# EAGLE design current_limiter (EAGLE 9.5.2)
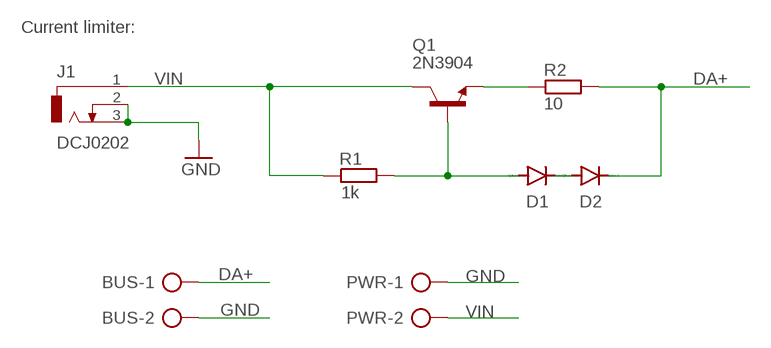
[diagram p0: schematic, sheet 1]

## Parts
BUS  AK500/2  [AK500/2]
D1  1N4004  [DO41-10]
D2  1N4004  [DO41-10]
J1  DCJ0202  [DCJ0202]
PWR  AK500/2  [AK500/2]
Q1  2N3904  BC449  [TO92-EBC]
R1  1k  R-EU_0207/10  [0207/10]
R2  10  R-EU_0207/10  [0207/10]

## Nets
DA+: BUS.1 D2.C R2.2
GND: BUS.2 J1.2 J1.3 PWR.1
N$2: D1.A Q1.B R1.2
N$8: D1.C D2.A
N$10: Q1.E R2.1
VIN: J1.1 PWR.2 Q1.C R1.1

## Notes on the sheet
- Current limiter:

## Library data of the parts
BUS PWR = con-ptr500:AK500/2: CONNECTOR; OC_FARNELL: unknown; OC_NEWARK: unknown
D1 D2 = diode:1N4004: DIODE general purpose rectifier, 1 A
J1 = con-jack:DCJ0202: DC POWER JACK Source: DCJ0202.pdf; OC_FARNELL: unknown; OC_NEWARK: unknown
Q1 = transistor-npn:BC449*: NPN Transistor
R1 R2 = rcl:R-EU_: RESISTOR, European symbol; SPICEPREFIX: R

## Board
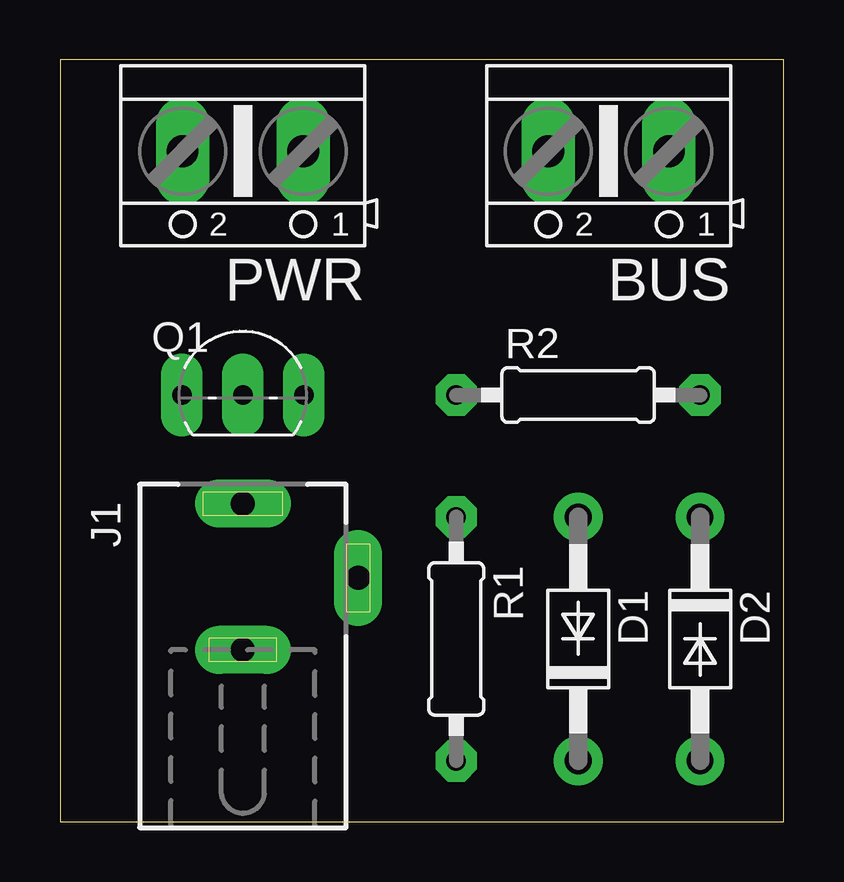
[diagram p1: board, top side]
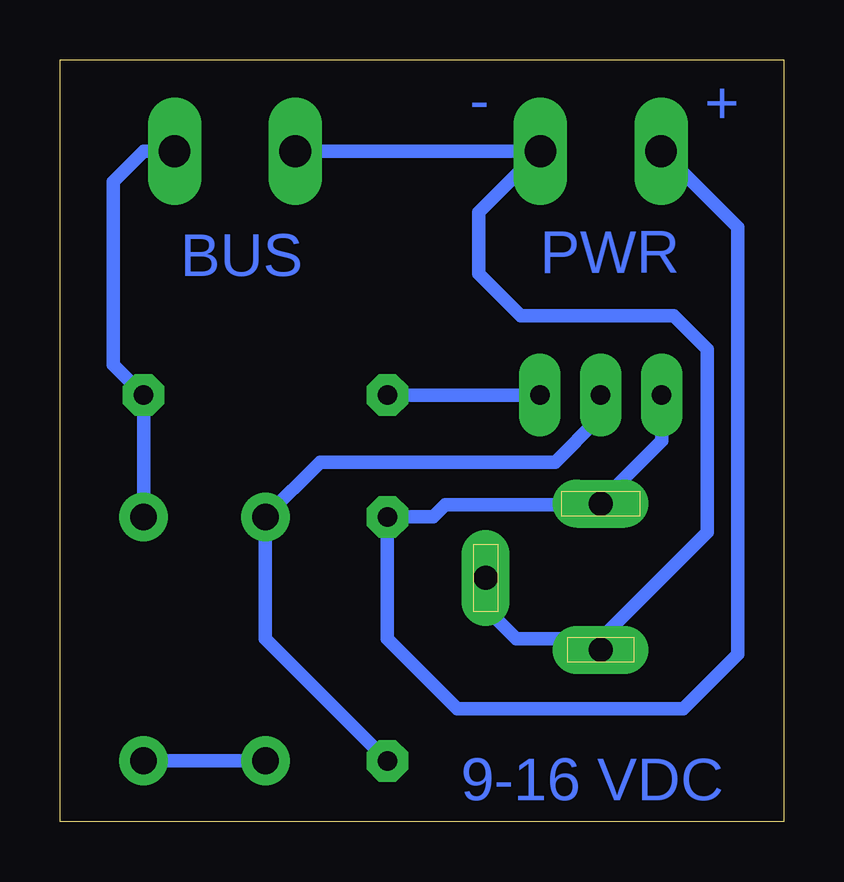
[diagram p2: board, bottom side, seen from below]

Size 30.15 x 31.74 mm. Coordinates in mm from the lower left corner, seen from the top.
Outline: 0,0 30.15,0 30.15,31.74 0,31.74 0,0
Copper layers (1*16): Top 0.035mm / dielectric 1.5mm / Bottom 0.035mm
Design rules "default *": minimum track width 22mil, minimum drill 0.35mm, track to track 18mil, track to pad 18mil, pad to pad 18mil, via to via 6mil, smd to smd 6mil, copper to edge 40mil, drill to drill 6mil, minimum pad ring 18mil, minimum via ring 8mil, stop-mask expansion 4mil, vias tented up to drill 0mil, thermal gap 10mil

### Footprints (pad centres in the part's own frame; a part is rotated, then mirrored left to right if it is on the bottom)
AK500/2 = drill 1.321 long: 1 -2.515,0; 2 2.515,0
DO41-10 = drill 1.118: A 5.08,0; C -5.08,0
DCJ0202 = drill 1 pad 2 long: 1 0,3.1; 2 4.8,0; 3 0,-3
TO92-EBC = drill 0.813 long: B 0,-1.27; C -2.54,-1.27; E 2.54,-1.27
0207/10 = drill 0.813 octagon: 1 -5.08,0; 2 5.08,0

### Placement (x,y rotation side)
BUS  22.86,27.94 180 top
D1  21.59,7.62 90 top
D2  26.67,7.62 270 top
J1  7.62,10.16 0 top
PWR  7.62,27.94 180 top
Q1  7.62,19.05 0 top
R1  16.51,7.62 270 top
R2  21.59,17.78 0 top

### Tracks (layer width: path | path; a pad name or v marks a point on that pad's centre or on a via)
DA+
  Bottom 0.559: D2.C R2.2 27.94,19.05 27.94,26.67 26.67,27.94 BUS.1
GND
  Bottom 0.559: 7.62,7.62 11.15,7.62 12.42,8.89 J1.2 | BUS.2 10.16,27.94 | 10.16,27.94 PWR.1 | 7.62,7.62 3.17,12.06 3.17,19.68 4.57,21.08 10.95,21.08 12.7,22.84 12.7,25.4 10.16,27.94 | 7.62,7.62 J1.3
N$2
  Bottom 0.559: R1.2 21.59,7.62 D1.A 19.3,14.99 9.53,14.99 7.75,16.76 7.75,17.65 Q1.B
N$8
  Bottom 0.559: D2.A D1.C
N$10
  Bottom 0.559: R2.1 Q1.E
VIN
  Bottom 0.559: Q1.C 5.08,15.88 7.62,13.34 | 7.62,13.34 7.75,13.21 14.1,13.21 14.61,12.7 R1.1 16.51,7.62 13.59,4.7 4.19,4.7 1.91,6.99 1.91,24.77 5.08,27.94 PWR.2 | 7.62,13.34 J1.1

### Text on the board
Bottom: + | - | PWR | BUS | 9-16 VDC